# Altium schematic sheet Audio.SchDoc
size A4; Revision: C.2
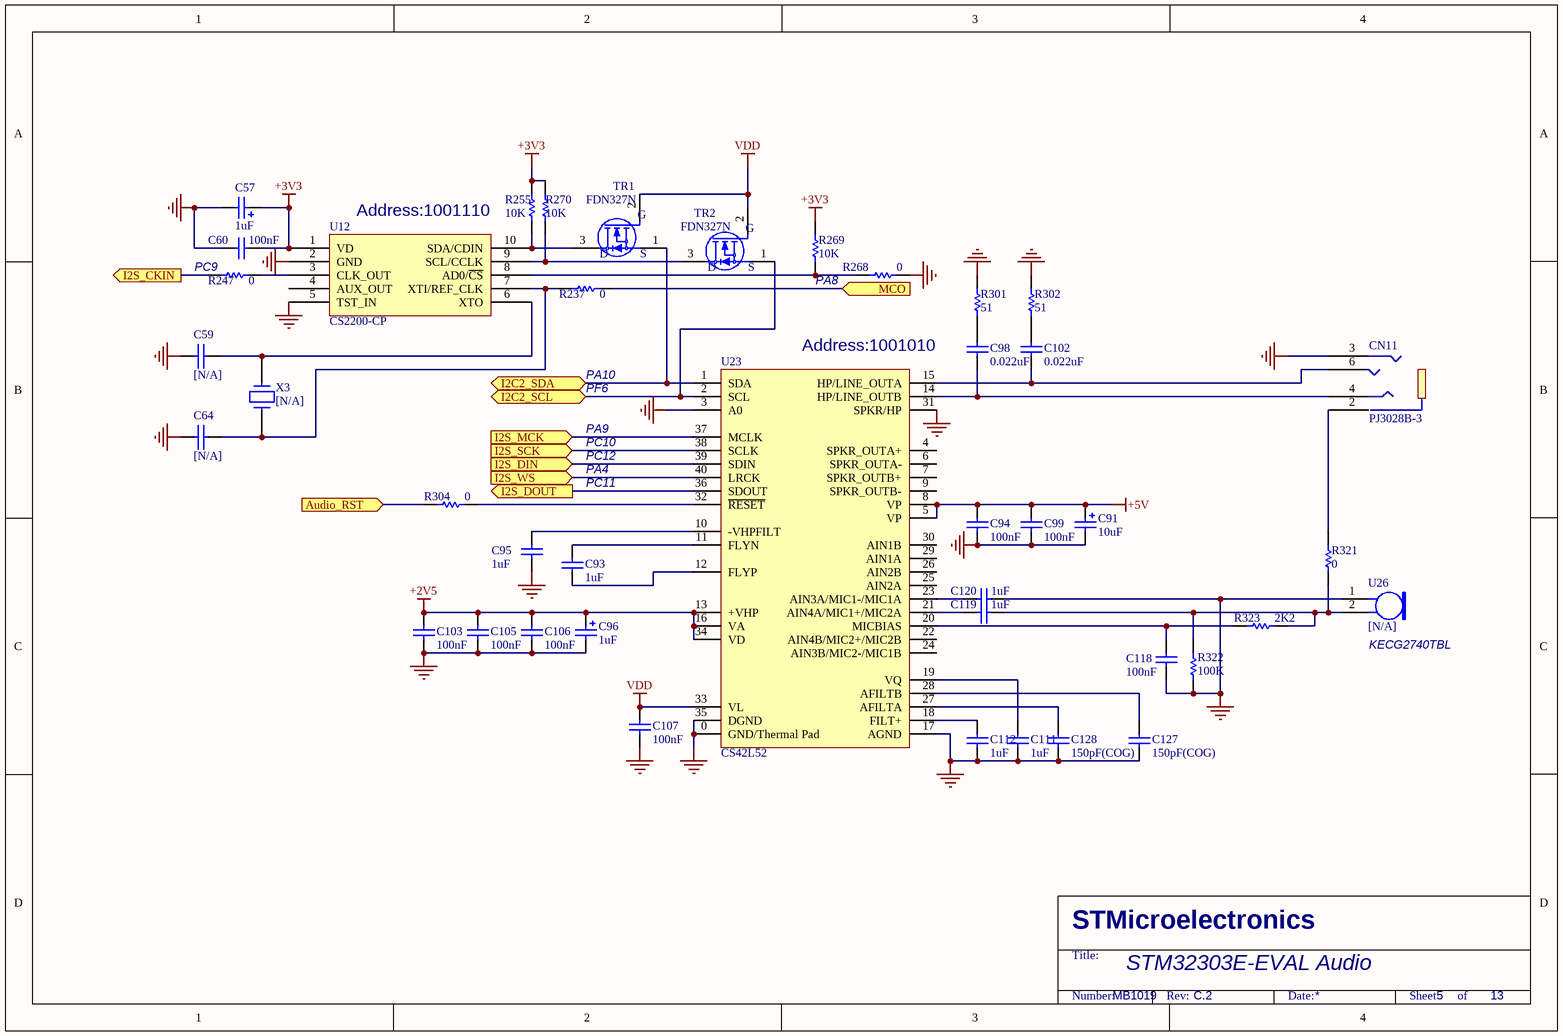
[diagram p0: Audio.SchDoc]

## Parts
C57  1uF  [TAN-A]
C59  [N/A]  [0603C]
C60  100nF  [0603C]
C64  [N/A]  [0603C]
C91  10uF  [TAN-A]
C93  1uF  [0603C]
C94  100nF  [0603C]
C95  1uF  [0603C]
C96  1uF  [TAN-A]
C98  0.022uF  [0603C]
C99  100nF  [0603C]
C102  0.022uF  [0603C]
C103  100nF  [0603C]
C105  100nF  [0603C]
C106  100nF  [0603C]
C107  100nF  [0603C]
C111  1uF  [0603C]
C112  1uF  [0603C]
C118  100nF  [0603C]
C119  1uF  [0603C]
C120  1uF  [0603C]
C127  150pF(COG)  [0603C]
C128  150pF(COG)  [0603C]
CN11  PJ3028B-3  [PJ3028B]
R237  0  [0603R]
R247  0  [0603R]
R255  10K  [0603R]
R268  0  [0603R]
R269  10K  [0603R]
R270  10K  [0603R]
R301  51  [0603R]
R302  51  [0603R]
R304  0  [0603R]
R321  0  [0603R]
R322  100K  [0603R]
R323  2K2  [0603R]
TR1  FDN327N  [SOT-23]
TR2  FDN327N  [SOT-23]
U12  CS2200-CP  [MSOP10(0.5)]
U23  CS42L52  [QFN40(6*6)]
U26  [N/A]  [KEC2740]
X3  [N/A]  [XTAL_socket]

## Ports
Audio_RST (in), I2C2_SCL (bidir), I2C2_SDA (bidir), I2S_CKIN (out), I2S_DIN (in), I2S_DOUT (out), I2S_MCK (in), I2S_SCK (in), I2S_WS (in), MCO (in)

## Nets
+2V5: C96.1 C103.1 C105.1 C106.1 U23.13(+VHP) U23.16(VA) U23.34(VD)
+3V3: C57.1 C60.1 R255.1 R269.1 R270.1 U12.1(VD)
+5V: C91.1 C94.1 C99.1 U23.5(VP) U23.8(VP)
GND: C57.2 C59.2 C60.2 C64.2 C91.2 C94.2 C95.2 C96.2 C99.2 C103.2 C105.2 C106.2 C107.2 C111.1 C112.1 C118.2 C120.2 C127.1 C128.1 CN11.3 R268.1 R301.1 R302.1 R322.2 U12.2(GND) U12.5(TST_IN) U23.0(GND/Thermal_Pad) U23.3(A0) U23.17(AGND) U23.31(SPKR/HP) U23.35(DGND) U26.1
VDD: C107.1 TR1.2(G) TR2.2(G) U23.33(VL)
Audio_RST: R304.2 ; port Audio_RST
I2C2_SCL: TR2.1(S) U23.2(SCL) ; port I2C2_SCL
I2C2_SDA: TR1.1(S) U23.1(SDA) ; port I2C2_SDA
I2S_CKIN: R247.2 ; port I2S_CKIN
I2S_DIN: U23.39(SDIN) ; port I2S_DIN
I2S_DOUT: U23.36(SDOUT) ; port I2S_DOUT
I2S_MCK: U23.37(MCLK) ; port I2S_MCK
I2S_SCK: U23.38(SCLK) ; port I2S_SCK
I2S_WS: U23.40(LRCK) ; port I2S_WS
MCO: R237.1 ; port MCO
NetC59_1: C59.1 U12.6(XTO) X3.2
NetC64_1: C64.1 R237.2 U12.7(XTI/REF_CLK) X3.1
NetC93_1: C93.1 U23.12(FLYP)
NetC93_2: C93.2 U23.11(FLYN)
NetC95_1: C95.1 U23.10(-VHPFILT)
NetC98_1: C98.1 R301.2
NetC98_2: C98.2 CN11.4 U23.14(HP/LINE_OUTB)
NetC102_1: C102.1 R302.2
NetC102_2: C102.2 CN11.6 U23.15(HP/LINE_OUTA)
NetC111_2: C111.2 U23.19(VQ)
NetC112_2: C112.2 U23.18(FILT+)
NetC118_1: C118.1 R323.2 U23.20(MICBIAS)
NetC119_1: C119.1 U23.21(AIN4A/MIC1+/MIC2A)
NetC119_2: C119.2 R321.1 R322.1 R323.1 U26.2
NetC120_1: C120.1 U23.23(AIN3A/MIC1-/MIC1A)
NetC127_2: C127.2 U23.28(AFILTB)
NetC128_2: C128.2 U23.27(AFILTA)
NetCN11_2: CN11.2 R321.2
NetR247_1: R247.1 U12.3(CLK_OUT)
NetR255_2: R255.2 TR1.3(D) U12.10(SDA/CDIN)
NetR268_2: R268.2 R269.2 U12.8(AD0/~{CS})
NetR270_2: R270.2 TR2.3(D) U12.9(SCL/CCLK)
NetR304_1: R304.1 U23.32(~{RESET})

Not connected (* = marked no-connect by the designer): U12 4(AUX_OUT); U23 4(SPKR_OUTA+) 6(SPKR_OUTA-) 7(SPKR_OUTB+) 9(SPKR_OUTB-) 22(AIN4B/MIC2+/MIC2B) 24(AIN3B/MIC2-/MIC1B) 25(AIN2A) 26(AIN2B) 29(AIN1A) 30(AIN1B)

## Notes on the sheet
- (near U12) Address:1001110
- (near R247) PC9
- (near R269) PA8
- PA10
- (near U23) Address:1001010
- PA9
- PC10
- PF6
- PA4
- PC12
- PC11
- (near U26) KECG2740TBL
- STM32303E-EVAL Audio
- MB1019
- 5
- 13
- STMicroelectronics
- Title:
- Number:
- Rev:
- Date:
- Sheet       of

## Library data of the parts
C57 C96 = Cap Pol1: Polarized Capacitor (Radial); Value: 47uF; Published: 8-Jun-2000; Revision: July-2002: Re-released for DXP Platform.; Publisher: Altium Limited
C59 C60 C64 = CAP: Capacitor
  C60: Published: 8-Jun-2000; Revision: July-2002: Re-released for DXP Platform.; Publisher: Altium Limited; Value: 100nF
C91 = Cap Pol1: Polarized Capacitor (Radial); Published: 8-Jun-2000; Revision: July-2002: Re-released for DXP Platform.; Publisher: Altium Limited; Value: 10uF
C93 C95 C98 C102 C111 C112 C119 C120 C127 C128 = CAP: Capacitor; Value: 100nF; Published: 8-Jun-2000; Revision: July-2002: Re-released for DXP Platform.; Publisher: Altium Limited
C94 C99 C103 C105-C107 C118 = Cap: Capacitor; Value: 10nF; Published: 8-Jun-2000; Revision: July-2002: Re-released for DXP Platform.; Publisher: Altium Limited
R237 R268 R301 R302 R321 R322 = res1: Resistor; Value: 1K; Published: 8-Jun-2000; Revision: July-2002: Re-released for DXP Platform.; Publisher: Altium Limited
R247 R255 R269 R270 R304 R323 = Res1: Resistor; Value: 1K; Published: 8-Jun-2000; Revision: July-2002: Re-released for DXP Platform.; Publisher: Altium Limited
TR1 TR2 = 2N7000
U26 = Mic2: Microphone; Published: 24-Mar-1999; Revision: July-2002: Re-released for DXP Platform.; Publisher: Altium Limited
X3 = CRYSTAL